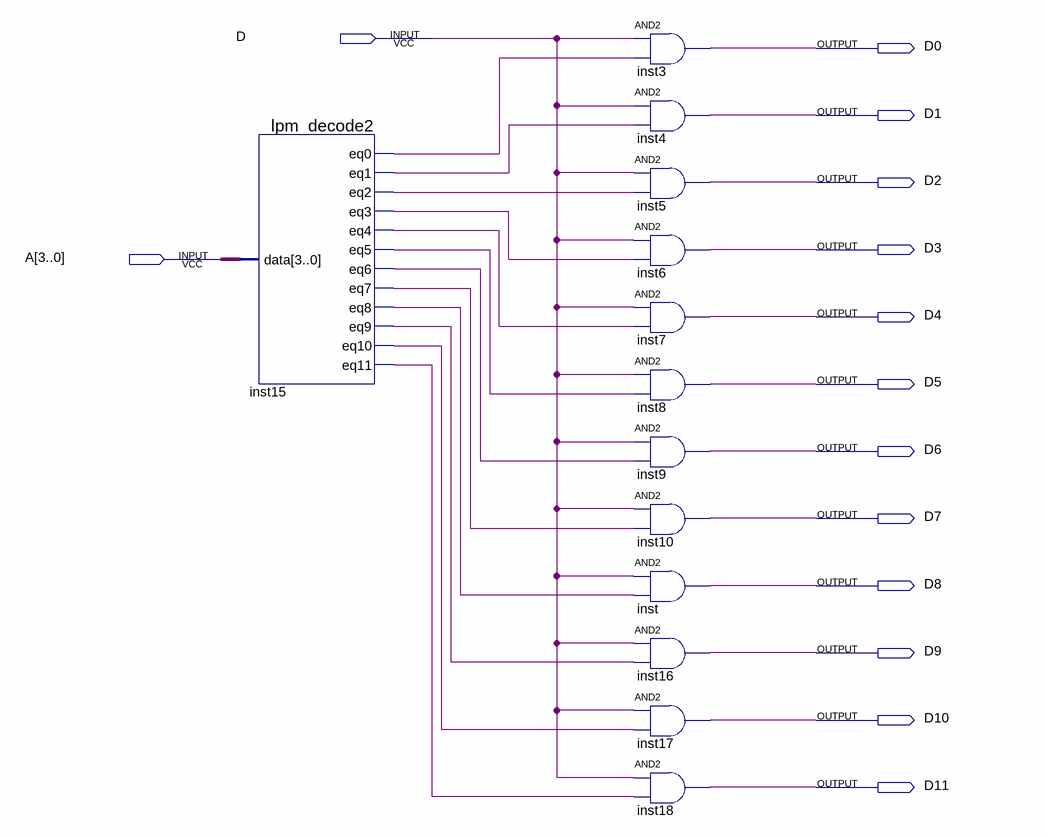
[diagram p0: schematic sheet]
// Quartus schematic dmx_4x12.bdf as structural Verilog: 13 symbols, 14 pins
module dmx_4x12 (
  input  D,
  input  [3:0] A,
  output D0,
  output D1,
  output D2,
  output D3,
  output D4,
  output D5,
  output D6,
  output D7,
  output D8,
  output D9,
  output D10,
  output D11
);

  wire inst15_eq0, inst15_eq1, inst15_eq2, inst15_eq3, inst15_eq4, inst15_eq5, inst15_eq6, inst15_eq7,
       inst15_eq8, inst15_eq9, inst15_eq10, inst15_eq11;

  lpm_decode2 inst15 (
    .data(A), .eq0(inst15_eq0), .eq1(inst15_eq1), .eq2(inst15_eq2), .eq3(inst15_eq3), .eq4(inst15_eq4),
    .eq5(inst15_eq5), .eq6(inst15_eq6), .eq7(inst15_eq7), .eq8(inst15_eq8), .eq9(inst15_eq9),
    .eq10(inst15_eq10), .eq11(inst15_eq11));
  and inst3 (D0, D, inst15_eq0);
  and inst4 (D1, D, inst15_eq1);
  and inst5 (D2, D, inst15_eq2);
  and inst6 (D3, D, inst15_eq3);
  and inst7 (D4, D, inst15_eq4);
  and inst8 (D5, D, inst15_eq5);
  and inst9 (D6, D, inst15_eq6);
  and inst10 (D7, D, inst15_eq7);
  and inst (D8, D, inst15_eq8);
  and inst16 (D9, D, inst15_eq9);
  and inst17 (D10, D, inst15_eq10);
  and inst18 (D11, D, inst15_eq11);
endmodule
